# Altium schematic sheet Motor4_PCIe.SchDoc
size B
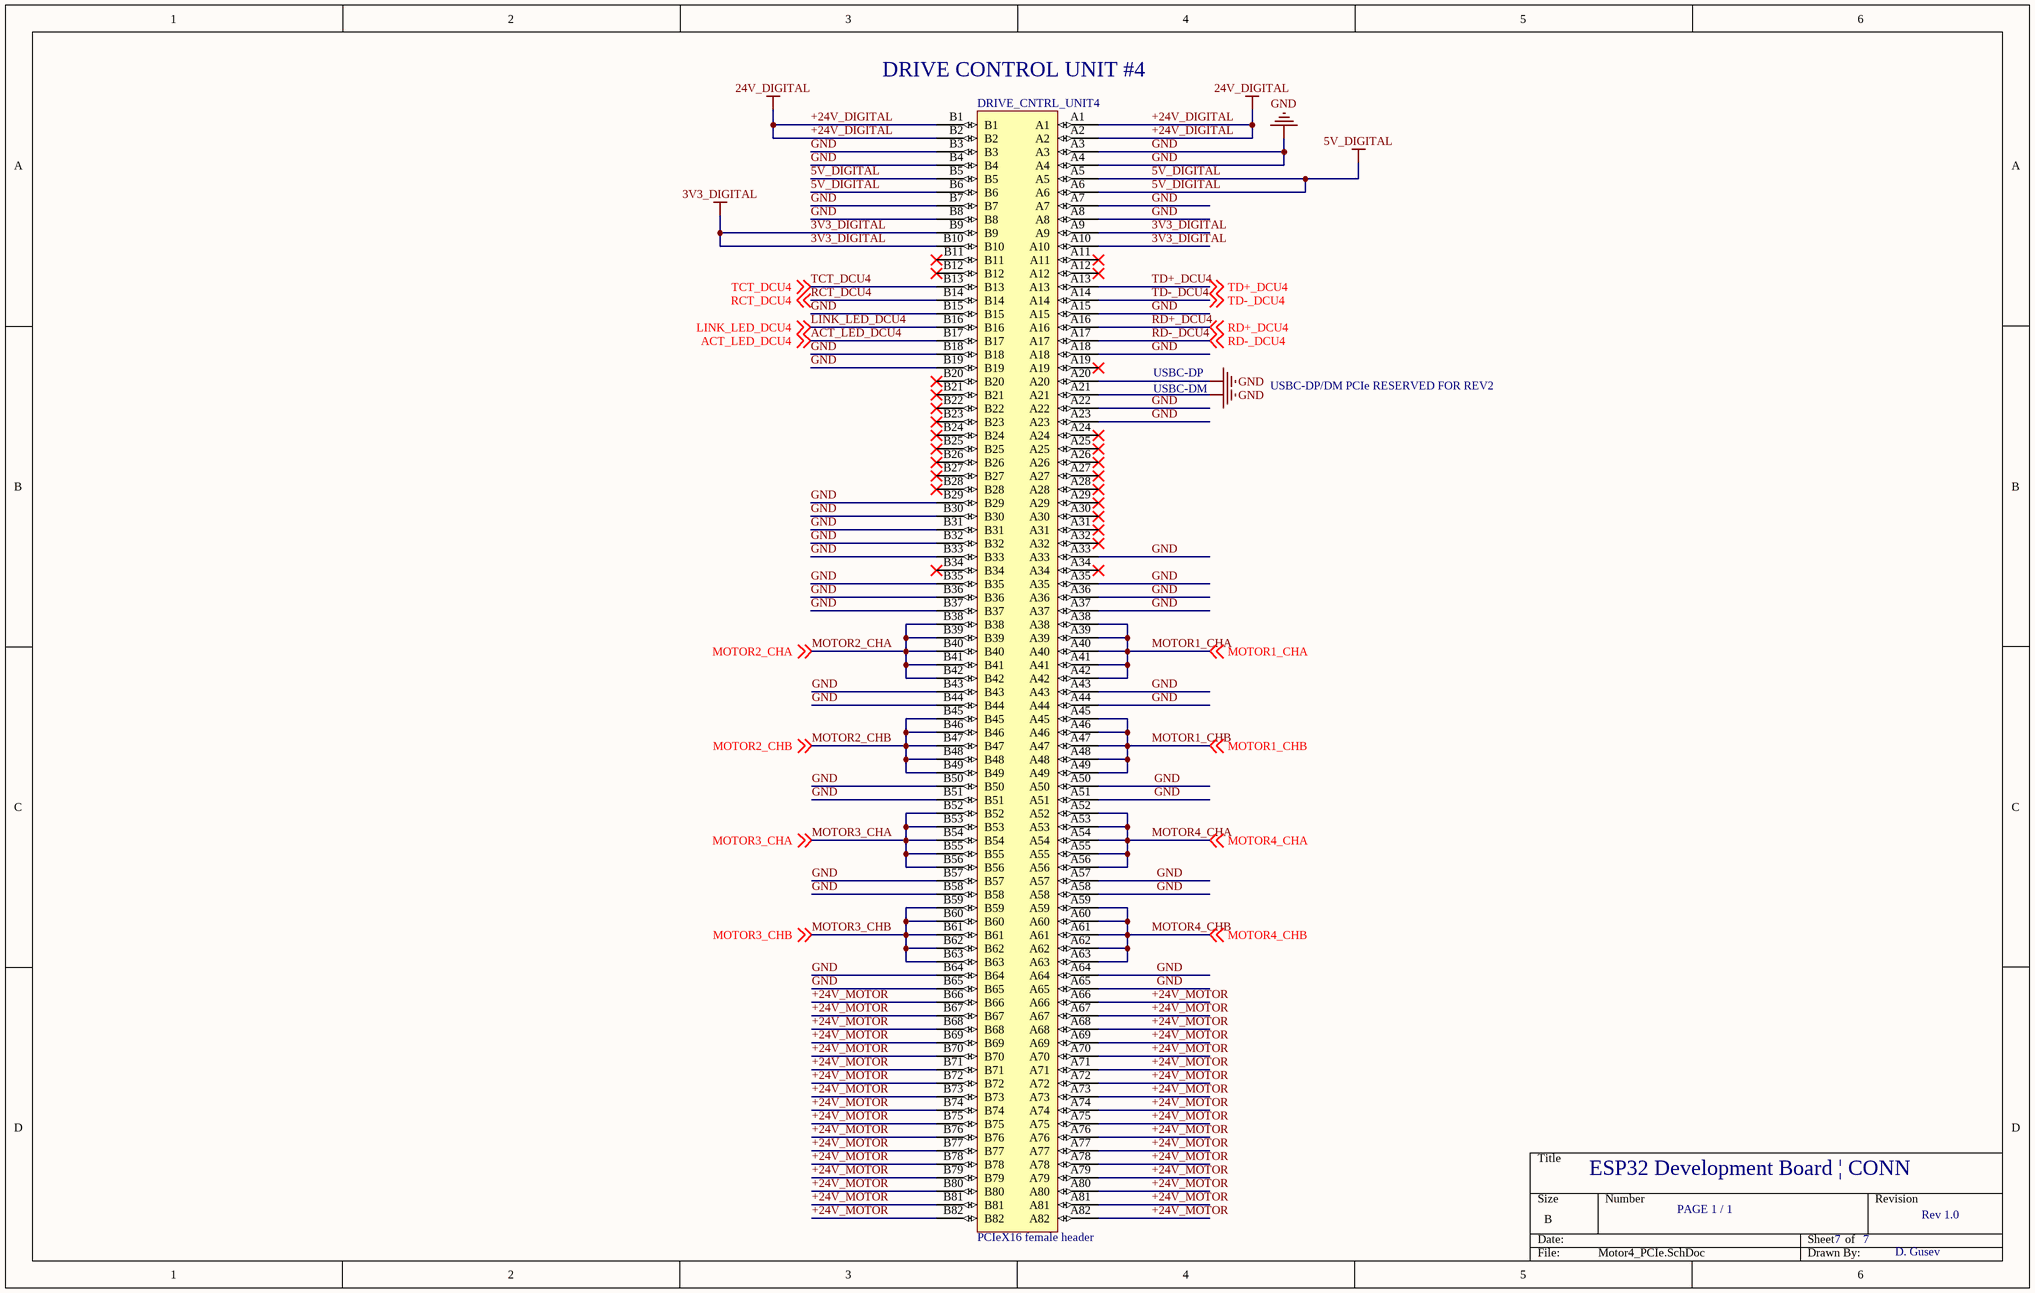
[diagram p0: Motor4_PCIe.SchDoc]

## Parts
DRIVE_CNTRL_UNIT4  PCIeX16 female header  [SAMTEC_PCIE-164-02-X-D-TH]

## Nets
3V3_DIGITAL: DRIVE_CNTRL_UNIT4.A9 DRIVE_CNTRL_UNIT4.A10 DRIVE_CNTRL_UNIT4.B9 DRIVE_CNTRL_UNIT4.B10
5V_DIGITAL: DRIVE_CNTRL_UNIT4.A5 DRIVE_CNTRL_UNIT4.A6 DRIVE_CNTRL_UNIT4.B5 DRIVE_CNTRL_UNIT4.B6
+24V_DIGITAL: DRIVE_CNTRL_UNIT4.A1 DRIVE_CNTRL_UNIT4.A2 DRIVE_CNTRL_UNIT4.B1 DRIVE_CNTRL_UNIT4.B2  [also labelled 24V_DIGITAL]
GND: DRIVE_CNTRL_UNIT4.A3 DRIVE_CNTRL_UNIT4.A4 DRIVE_CNTRL_UNIT4.A7 DRIVE_CNTRL_UNIT4.A8 DRIVE_CNTRL_UNIT4.A15 DRIVE_CNTRL_UNIT4.A18 DRIVE_CNTRL_UNIT4.A20 DRIVE_CNTRL_UNIT4.A21 DRIVE_CNTRL_UNIT4.A22 DRIVE_CNTRL_UNIT4.A23 DRIVE_CNTRL_UNIT4.A33 DRIVE_CNTRL_UNIT4.A35 DRIVE_CNTRL_UNIT4.A36 DRIVE_CNTRL_UNIT4.A37 DRIVE_CNTRL_UNIT4.A43 DRIVE_CNTRL_UNIT4.A44 DRIVE_CNTRL_UNIT4.A50 DRIVE_CNTRL_UNIT4.A51 DRIVE_CNTRL_UNIT4.A57 DRIVE_CNTRL_UNIT4.A58 DRIVE_CNTRL_UNIT4.A64 DRIVE_CNTRL_UNIT4.A65 DRIVE_CNTRL_UNIT4.B3 DRIVE_CNTRL_UNIT4.B4 DRIVE_CNTRL_UNIT4.B7 DRIVE_CNTRL_UNIT4.B8 DRIVE_CNTRL_UNIT4.B15 DRIVE_CNTRL_UNIT4.B18 DRIVE_CNTRL_UNIT4.B19 DRIVE_CNTRL_UNIT4.B29 DRIVE_CNTRL_UNIT4.B30 DRIVE_CNTRL_UNIT4.B31 DRIVE_CNTRL_UNIT4.B32 DRIVE_CNTRL_UNIT4.B33 DRIVE_CNTRL_UNIT4.B35 DRIVE_CNTRL_UNIT4.B36 DRIVE_CNTRL_UNIT4.B37 DRIVE_CNTRL_UNIT4.B43 DRIVE_CNTRL_UNIT4.B44 DRIVE_CNTRL_UNIT4.B50 DRIVE_CNTRL_UNIT4.B51 DRIVE_CNTRL_UNIT4.B57 DRIVE_CNTRL_UNIT4.B58 DRIVE_CNTRL_UNIT4.B64 DRIVE_CNTRL_UNIT4.B65
+24V_MOTOR: DRIVE_CNTRL_UNIT4.A66 DRIVE_CNTRL_UNIT4.A67 DRIVE_CNTRL_UNIT4.A68 DRIVE_CNTRL_UNIT4.A69 DRIVE_CNTRL_UNIT4.A70 DRIVE_CNTRL_UNIT4.A71 DRIVE_CNTRL_UNIT4.A72 DRIVE_CNTRL_UNIT4.A73 DRIVE_CNTRL_UNIT4.A74 DRIVE_CNTRL_UNIT4.A75 DRIVE_CNTRL_UNIT4.A76 DRIVE_CNTRL_UNIT4.A77 DRIVE_CNTRL_UNIT4.A78 DRIVE_CNTRL_UNIT4.A79 DRIVE_CNTRL_UNIT4.A80 DRIVE_CNTRL_UNIT4.A81 DRIVE_CNTRL_UNIT4.A82 DRIVE_CNTRL_UNIT4.B66 DRIVE_CNTRL_UNIT4.B67 DRIVE_CNTRL_UNIT4.B68 DRIVE_CNTRL_UNIT4.B69 DRIVE_CNTRL_UNIT4.B70 DRIVE_CNTRL_UNIT4.B71 DRIVE_CNTRL_UNIT4.B72 DRIVE_CNTRL_UNIT4.B73 DRIVE_CNTRL_UNIT4.B74 DRIVE_CNTRL_UNIT4.B75 DRIVE_CNTRL_UNIT4.B76 DRIVE_CNTRL_UNIT4.B77 DRIVE_CNTRL_UNIT4.B78 DRIVE_CNTRL_UNIT4.B79 DRIVE_CNTRL_UNIT4.B80 DRIVE_CNTRL_UNIT4.B81 DRIVE_CNTRL_UNIT4.B82
ACT_LED_DCU4: DRIVE_CNTRL_UNIT4.B17 ; off-sheet ACT_LED_DCU4
LINK_LED_DCU4: DRIVE_CNTRL_UNIT4.B16 ; off-sheet LINK_LED_DCU4
MOTOR1_CHA: DRIVE_CNTRL_UNIT4.A38 DRIVE_CNTRL_UNIT4.A39 DRIVE_CNTRL_UNIT4.A40 DRIVE_CNTRL_UNIT4.A41 DRIVE_CNTRL_UNIT4.A42 ; off-sheet MOTOR1_CHA
MOTOR1_CHB: DRIVE_CNTRL_UNIT4.A45 DRIVE_CNTRL_UNIT4.A46 DRIVE_CNTRL_UNIT4.A47 DRIVE_CNTRL_UNIT4.A48 DRIVE_CNTRL_UNIT4.A49 ; off-sheet MOTOR1_CHB
MOTOR2_CHA: DRIVE_CNTRL_UNIT4.B38 DRIVE_CNTRL_UNIT4.B39 DRIVE_CNTRL_UNIT4.B40 DRIVE_CNTRL_UNIT4.B41 DRIVE_CNTRL_UNIT4.B42 ; off-sheet MOTOR2_CHA
MOTOR2_CHB: DRIVE_CNTRL_UNIT4.B45 DRIVE_CNTRL_UNIT4.B46 DRIVE_CNTRL_UNIT4.B47 DRIVE_CNTRL_UNIT4.B48 DRIVE_CNTRL_UNIT4.B49 ; off-sheet MOTOR2_CHB
MOTOR3_CHA: DRIVE_CNTRL_UNIT4.B52 DRIVE_CNTRL_UNIT4.B53 DRIVE_CNTRL_UNIT4.B54 DRIVE_CNTRL_UNIT4.B55 DRIVE_CNTRL_UNIT4.B56 ; off-sheet MOTOR3_CHA
MOTOR3_CHB: DRIVE_CNTRL_UNIT4.B59 DRIVE_CNTRL_UNIT4.B60 DRIVE_CNTRL_UNIT4.B61 DRIVE_CNTRL_UNIT4.B62 DRIVE_CNTRL_UNIT4.B63 ; off-sheet MOTOR3_CHB
MOTOR4_CHA: DRIVE_CNTRL_UNIT4.A52 DRIVE_CNTRL_UNIT4.A53 DRIVE_CNTRL_UNIT4.A54 DRIVE_CNTRL_UNIT4.A55 DRIVE_CNTRL_UNIT4.A56 ; off-sheet MOTOR4_CHA
MOTOR4_CHB: DRIVE_CNTRL_UNIT4.A59 DRIVE_CNTRL_UNIT4.A60 DRIVE_CNTRL_UNIT4.A61 DRIVE_CNTRL_UNIT4.A62 DRIVE_CNTRL_UNIT4.A63 ; off-sheet MOTOR4_CHB
RCT_DCU4: DRIVE_CNTRL_UNIT4.B14 ; off-sheet RCT_DCU4
RD+_DCU4: DRIVE_CNTRL_UNIT4.A16 ; off-sheet RD+_DCU4
RD-_DCU4: DRIVE_CNTRL_UNIT4.A17 ; off-sheet RD-_DCU4
TCT_DCU4: DRIVE_CNTRL_UNIT4.B13 ; off-sheet TCT_DCU4
TD+_DCU4: DRIVE_CNTRL_UNIT4.A13 ; off-sheet TD+_DCU4
TD-_DCU4: DRIVE_CNTRL_UNIT4.A14 ; off-sheet TD-_DCU4

Not connected (* = marked no-connect by the designer): DRIVE_CNTRL_UNIT4 A11* A12* A19* A24* A25* A26* A27* A28* A29* A30* A31* A32* A34* B11* B12* B20* B21* B22* B23* B24* B25* B26* B27* B28* B34*

## Notes on the sheet
- (near DRIVE_CNTRL_UNIT4) DRIVE CONTROL UNIT #4
- USBC-DP
- USBC-DM
- USBC-DP/DM PCIe RESERVED FOR REV2
- ESP32 Development Board | CONN
- PAGE 1 / 1
- 7
- Rev 1.0
- D. Gusev

## Library data of the parts
DRIVE_CNTRL_UNIT4 = PCIeX16 female header: 164-position SAMTEC female header